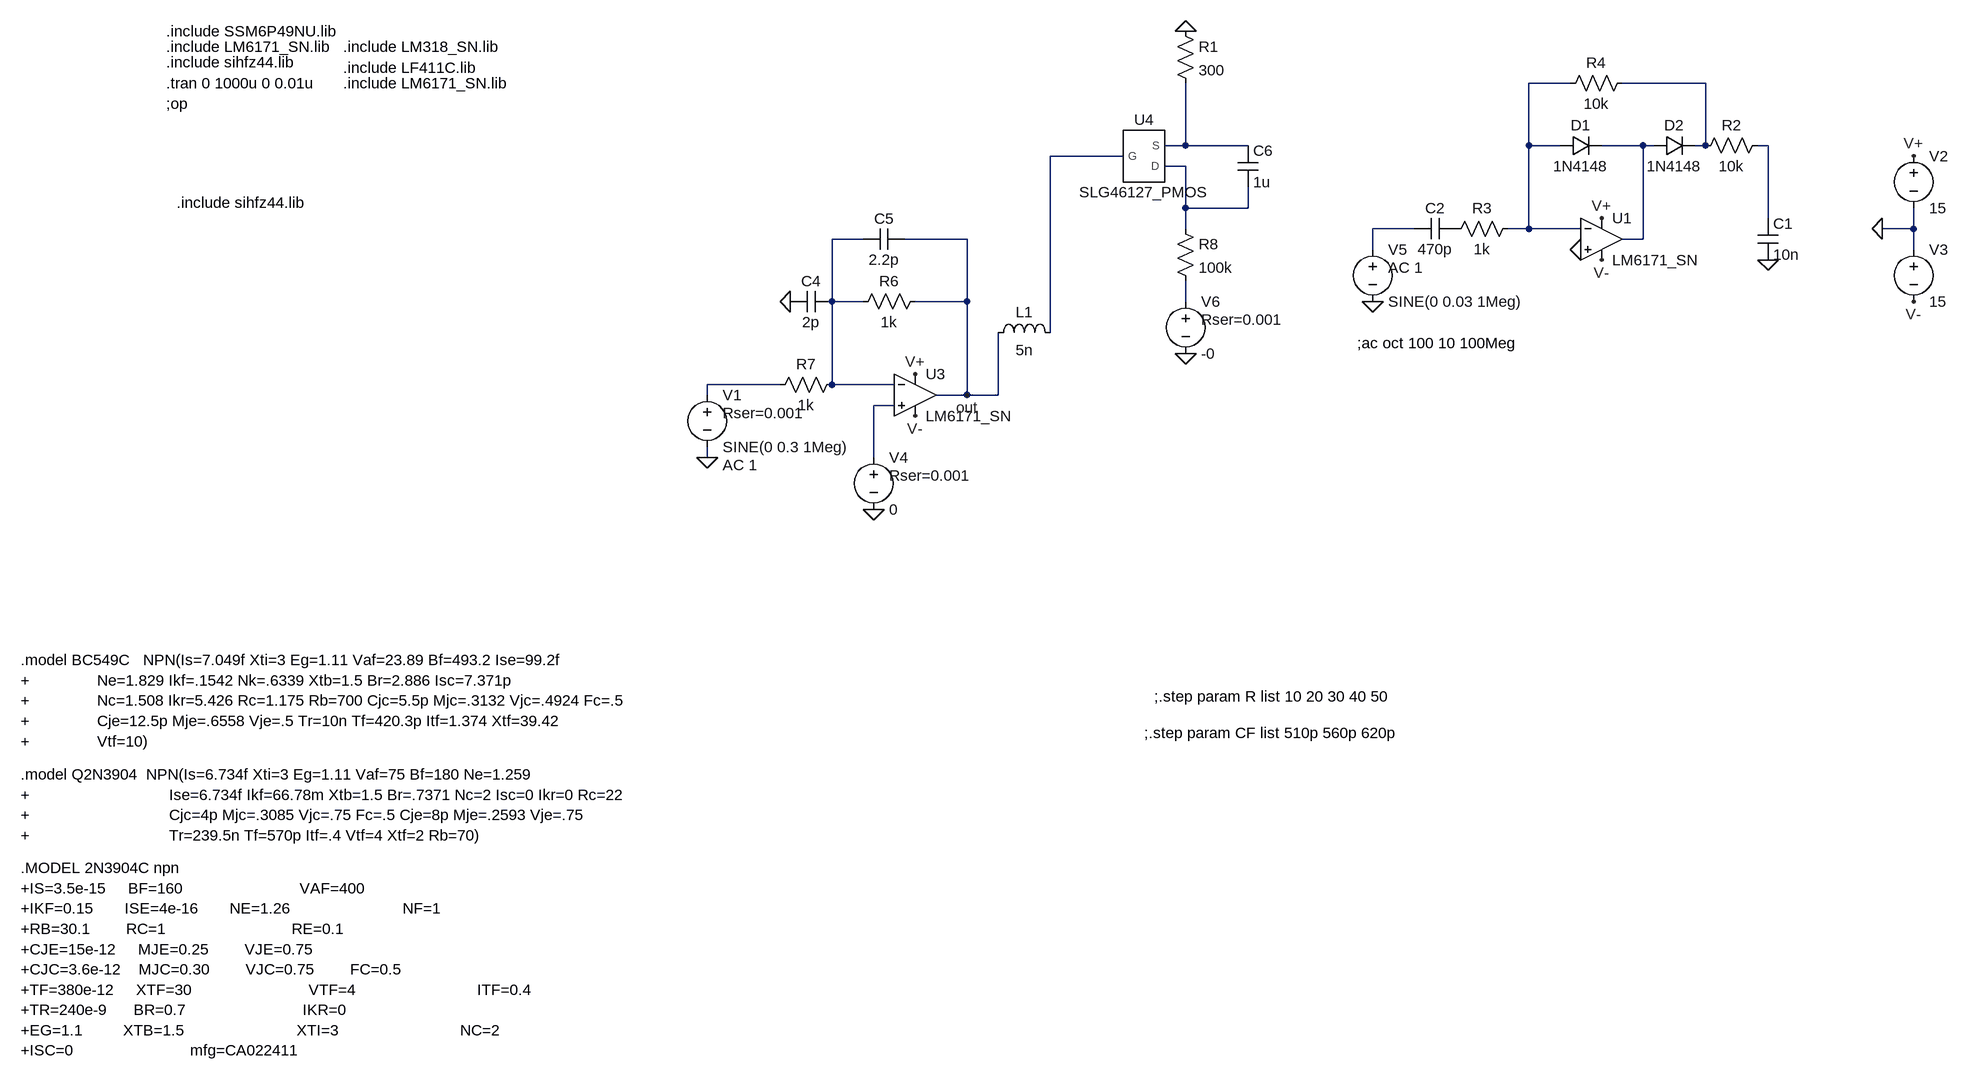
[diagram p0: schematic PFETchar3.asc]
PFETchar3.asc, the LTspice schematic file:
Version 4
SHEET 1 2640 1060
WIRE 1088 -416 1024 -416
WIRE 1296 -416 1168 -416
WIRE 496 -320 496 -416
WIRE 496 -320 464 -320
WIRE 592 -320 496 -320
WIRE 1024 -320 1024 -416
WIRE 1072 -320 1024 -320
WIRE 1200 -320 1136 -320
WIRE 1216 -320 1200 -320
WIRE 1296 -320 1296 -416
WIRE 1296 -320 1280 -320
WIRE 1392 -320 1376 -320
WIRE 400 -304 288 -304
WIRE 496 -288 464 -288
WIRE 496 -224 496 -288
WIRE 592 -224 592 -256
WIRE 592 -224 496 -224
WIRE 1392 -208 1392 -320
WIRE 496 -192 496 -224
WIRE 848 -192 784 -192
WIRE 1024 -192 1024 -320
WIRE 1024 -192 992 -192
WIRE 1104 -192 1024 -192
WIRE 1616 -192 1616 -224
WIRE 1616 -192 1568 -192
WIRE 0 -176 -48 -176
WIRE 160 -176 64 -176
WIRE 1200 -176 1200 -320
WIRE 1200 -176 1168 -176
WIRE 784 -160 784 -192
WIRE 1616 -160 1616 -192
WIRE -48 -80 -48 -176
WIRE 0 -80 -48 -80
WIRE 160 -80 160 -176
WIRE 160 -80 80 -80
WIRE 496 -80 496 -112
WIRE 288 -32 288 -304
WIRE -128 48 -240 48
WIRE -48 48 -48 -80
WIRE 48 48 -48 48
WIRE -240 64 -240 48
WIRE 160 64 160 -80
WIRE 160 64 112 64
WIRE 208 64 208 -32
WIRE 208 64 160 64
WIRE 48 80 16 80
WIRE -240 160 -240 144
WIRE 16 160 16 80
FLAG 16 240 0
FLAG 496 -496 0
FLAG 1568 -192 0
FLAG 1616 -304 V+
FLAG 1136 -208 V+
FLAG 1136 -144 V-
FLAG 1616 -80 V-
FLAG 784 -80 0
FLAG 1104 -160 0
FLAG 1392 -144 0
FLAG 80 96 V-
FLAG 80 32 V+
FLAG -240 160 0
FLAG -112 -80 0
FLAG 160 64 out
FLAG 496 0 0
SYMBOL voltage 16 144 R0
WINDOW 123 0 0 Left 2
WINDOW 39 24 44 Left 2
SYMATTR SpiceLine Rser=0.001
SYMATTR InstName V4
SYMATTR Value 0
SYMBOL res 480 -512 R0
SYMATTR InstName R1
SYMATTR Value 300
SYMBOL Opamps\\opamp2 1136 -240 R0
SYMATTR InstName U1
SYMATTR Value LM6171_SN
SYMBOL diode 1072 -304 R270
WINDOW 0 32 32 VTop 2
WINDOW 3 0 32 VBottom 2
SYMATTR InstName D1
SYMATTR Value 1N4148
SYMBOL voltage 1616 -320 R0
WINDOW 123 0 0 Left 2
WINDOW 39 0 0 Left 2
SYMATTR InstName V2
SYMATTR Value 15
SYMBOL voltage 1616 -176 R0
WINDOW 123 0 0 Left 2
WINDOW 39 0 0 Left 2
SYMATTR InstName V3
SYMATTR Value 15
SYMBOL voltage 784 -176 R0
WINDOW 123 24 44 Left 2
WINDOW 39 0 0 Left 2
SYMATTR Value2 AC 1
SYMATTR InstName V5
SYMATTR Value SINE(0 0.03 1Meg)
SYMBOL diode 1216 -304 R270
WINDOW 0 32 32 VTop 2
WINDOW 3 0 32 VBottom 2
SYMATTR InstName D2
SYMATTR Value 1N4148
SYMBOL res 1008 -208 R90
WINDOW 0 0 56 VBottom 2
WINDOW 3 32 56 VTop 2
SYMATTR InstName R3
SYMATTR Value 1k
SYMBOL res 1184 -432 R90
WINDOW 0 0 56 VBottom 2
WINDOW 3 32 56 VTop 2
SYMATTR InstName R4
SYMATTR Value 10k
SYMBOL cap 1376 -208 R0
SYMATTR InstName C1
SYMATTR Value 10n
SYMBOL res 1392 -336 R90
WINDOW 0 0 56 VBottom 2
WINDOW 3 32 56 VTop 2
SYMATTR InstName R2
SYMATTR Value 10k
SYMBOL Opamps\\opamp2 80 0 R0
SYMATTR InstName U3
SYMATTR Value LM6171_SN
SYMBOL ind 192 -16 R270
WINDOW 0 32 56 VTop 2
WINDOW 3 5 56 VBottom 2
SYMATTR InstName L1
SYMATTR Value 5n
SYMBOL cap 912 -208 R90
WINDOW 0 0 32 VBottom 2
WINDOW 3 32 32 VTop 2
SYMATTR InstName C2
SYMATTR Value 470p
SYMBOL res 96 -96 R90
WINDOW 0 0 56 VBottom 2
WINDOW 3 32 56 VTop 2
SYMATTR InstName R6
SYMATTR Value 1k
SYMBOL res -32 32 R90
WINDOW 0 0 56 VBottom 2
WINDOW 3 32 56 VTop 2
SYMATTR InstName R7
SYMATTR Value 1k
SYMBOL cap -48 -96 R90
WINDOW 0 0 32 VBottom 2
WINDOW 3 32 32 VTop 2
SYMATTR InstName C4
SYMATTR Value 2p
SYMBOL cap 64 -192 R90
WINDOW 0 0 32 VBottom 2
WINDOW 3 32 32 VTop 2
SYMATTR InstName C5
SYMATTR Value 2.2p
SYMBOL cap 576 -320 R0
SYMATTR InstName C6
SYMATTR Value 1u
SYMBOL res 480 -208 R0
SYMATTR InstName R8
SYMATTR Value 100k
SYMBOL voltage 496 -96 R0
WINDOW 123 0 0 Left 2
WINDOW 39 24 44 Left 2
SYMATTR SpiceLine Rser=0.001
SYMATTR InstName V6
SYMATTR Value -0
SYMBOL voltage -240 48 R0
WINDOW 123 24 124 Left 2
WINDOW 39 24 44 Left 2
SYMATTR Value2 AC 1
SYMATTR SpiceLine Rser=0.001
SYMATTR InstName V1
SYMATTR Value SINE(0 0.3 1Meg)
SYMBOL SLG46127_PMOS 432 -304 R0
SYMATTR InstName U4
TEXT -1072 -384 Left 2 !;op
TEXT -1072 -472 Left 2 !.include LM6171_SN.lib
TEXT -1072 -416 Left 2 !.tran 0 1000u 0 0.01u
TEXT 432 584 Left 2 !;.step param CF list 510p 560p 620p
TEXT -1072 -448 Left 2 !.include sihfz44.lib
TEXT -1072 -496 Left 2 !.include SSM6P49NU.lib
TEXT 448 528 Left 2 !;.step param R list 10 20 30 40 50
TEXT -800 -472 Left 2 !.include LM318_SN.lib
TEXT -1296 472 Left 2 !.model BC549C   NPN(Is=7.049f Xti=3 Eg=1.11 Vaf=23.89 Bf=493.2 Ise=99.2f\n+               Ne=1.829 Ikf=.1542 Nk=.6339 Xtb=1.5 Br=2.886 Isc=7.371p\n+               Nc=1.508 Ikr=5.426 Rc=1.175 Rb=700 Cjc=5.5p Mjc=.3132 Vjc=.4924 Fc=.5\n+               Cje=12.5p Mje=.6558 Vje=.5 Tr=10n Tf=420.3p Itf=1.374 Xtf=39.42\n+               Vtf=10)
TEXT -1296 648 Left 2 !.model Q2N3904  NPN(Is=6.734f Xti=3 Eg=1.11 Vaf=75 Bf=180 Ne=1.259\n+                               Ise=6.734f Ikf=66.78m Xtb=1.5 Br=.7371 Nc=2 Isc=0 Ikr=0 Rc=22\n+                               Cjc=4p Mjc=.3085 Vjc=.75 Fc=.5 Cje=8p Mje=.2593 Vje=.75\n+                               Tr=239.5n Tf=570p Itf=.4 Vtf=4 Xtf=2 Rb=70)
TEXT -1296 792 Left 2 !.MODEL 2N3904C npn\n+IS=3.5e-15     BF=160                          VAF=400\n+IKF=0.15       ISE=4e-16       NE=1.26                         NF=1\n+RB=30.1        RC=1                            RE=0.1\n+CJE=15e-12     MJE=0.25        VJE=0.75\n+CJC=3.6e-12    MJC=0.30        VJC=0.75        FC=0.5\n+TF=380e-12     XTF=30                          VTF=4                           ITF=0.4\n+TR=240e-9      BR=0.7                          IKR=0\n+EG=1.1         XTB=1.5                         XTI=3                           NC=2\n+ISC=0                          mfg=CA022411
TEXT -1056 -232 Left 2 !.include sihfz44.lib
TEXT 760 -16 Left 2 !;ac oct 100 10 100Meg
TEXT -800 -440 Left 2 !.include LF411C.lib
TEXT -800 -416 Left 2 !.include LM6171_SN.lib

The netlist it stands for:
* PFETchar3.asc
V4 N012 0 0 Rser=0.001
R1 0 N003 300
XU1 0 N001 V+ V- N004 LM6171_SN  ; pins In+ In- V+ V- OUT
D1 N001 N004 1N4148
V2 V+ 0 15
V3 0 V- 15
V5 N008 0 SINE(0 0.03 1Meg) AC 1
D2 N004 N002 1N4148
R3 N001 P001 1k
R4 N002 N001 10k
C1 N005 0 10n
R2 N005 N002 10k
XU3 N012 N009 V+ V- out LM6171_SN  ; pins In+ In- V+ V- OUT
L1 out N006 5n
C2 P001 N008 470p
R6 out N009 1k
R7 N009 N011 1k
C4 N009 0 2p
C5 out N009 2.2p
C6 N003 N007 1u
R8 N007 N010 100k
V6 N010 0 -0 Rser=0.001
V1 N011 0 SINE(0 0.3 1Meg) AC 1 Rser=0.001
XU4 N007 N006 N003 SLG46127_PMOS  ; pins D G S
.model D D
.lib standard.dio
;op
.include LM6171_SN.lib
.tran 0 1000u 0 0.01u
;.step param CF list 510p 560p 620p
.include sihfz44.lib
.include SSM6P49NU.lib
;.step param R list 10 20 30 40 50
.include LM318_SN.lib
.model BC549C   NPN(Is=7.049f Xti=3 Eg=1.11 Vaf=23.89 Bf=493.2 Ise=99.2f
+               Ne=1.829 Ikf=.1542 Nk=.6339 Xtb=1.5 Br=2.886 Isc=7.371p
+               Nc=1.508 Ikr=5.426 Rc=1.175 Rb=700 Cjc=5.5p Mjc=.3132 Vjc=.4924 Fc=.5
+               Cje=12.5p Mje=.6558 Vje=.5 Tr=10n Tf=420.3p Itf=1.374 Xtf=39.42
+               Vtf=10)
.model Q2N3904  NPN(Is=6.734f Xti=3 Eg=1.11 Vaf=75 Bf=180 Ne=1.259
+                               Ise=6.734f Ikf=66.78m Xtb=1.5 Br=.7371 Nc=2 Isc=0 Ikr=0 Rc=22
+                               Cjc=4p Mjc=.3085 Vjc=.75 Fc=.5 Cje=8p Mje=.2593 Vje=.75
+                               Tr=239.5n Tf=570p Itf=.4 Vtf=4 Xtf=2 Rb=70)
.MODEL 2N3904C npn
+IS=3.5e-15     BF=160                          VAF=400
+IKF=0.15       ISE=4e-16       NE=1.26                         NF=1
+RB=30.1        RC=1                            RE=0.1
+CJE=15e-12     MJE=0.25        VJE=0.75
+CJC=3.6e-12    MJC=0.30        VJC=0.75        FC=0.5
+TF=380e-12     XTF=30                          VTF=4                           ITF=0.4
+TR=240e-9      BR=0.7                          IKR=0
+EG=1.1         XTB=1.5                         XTI=3                           NC=2
+ISC=0                          mfg=CA022411
.include sihfz44.lib
;ac oct 100 10 100Meg
.include LF411C.lib
.include LM6171_SN.lib
.lib SLG46127_PMOS.lib
.backanno
.end